# Altium schematic sheet FMCLPCConnector.SchDoc: FMC Connector
size Letter; ProjectTitle: Dan DfMux Mezz; ModelNumber: MGMEZZ04
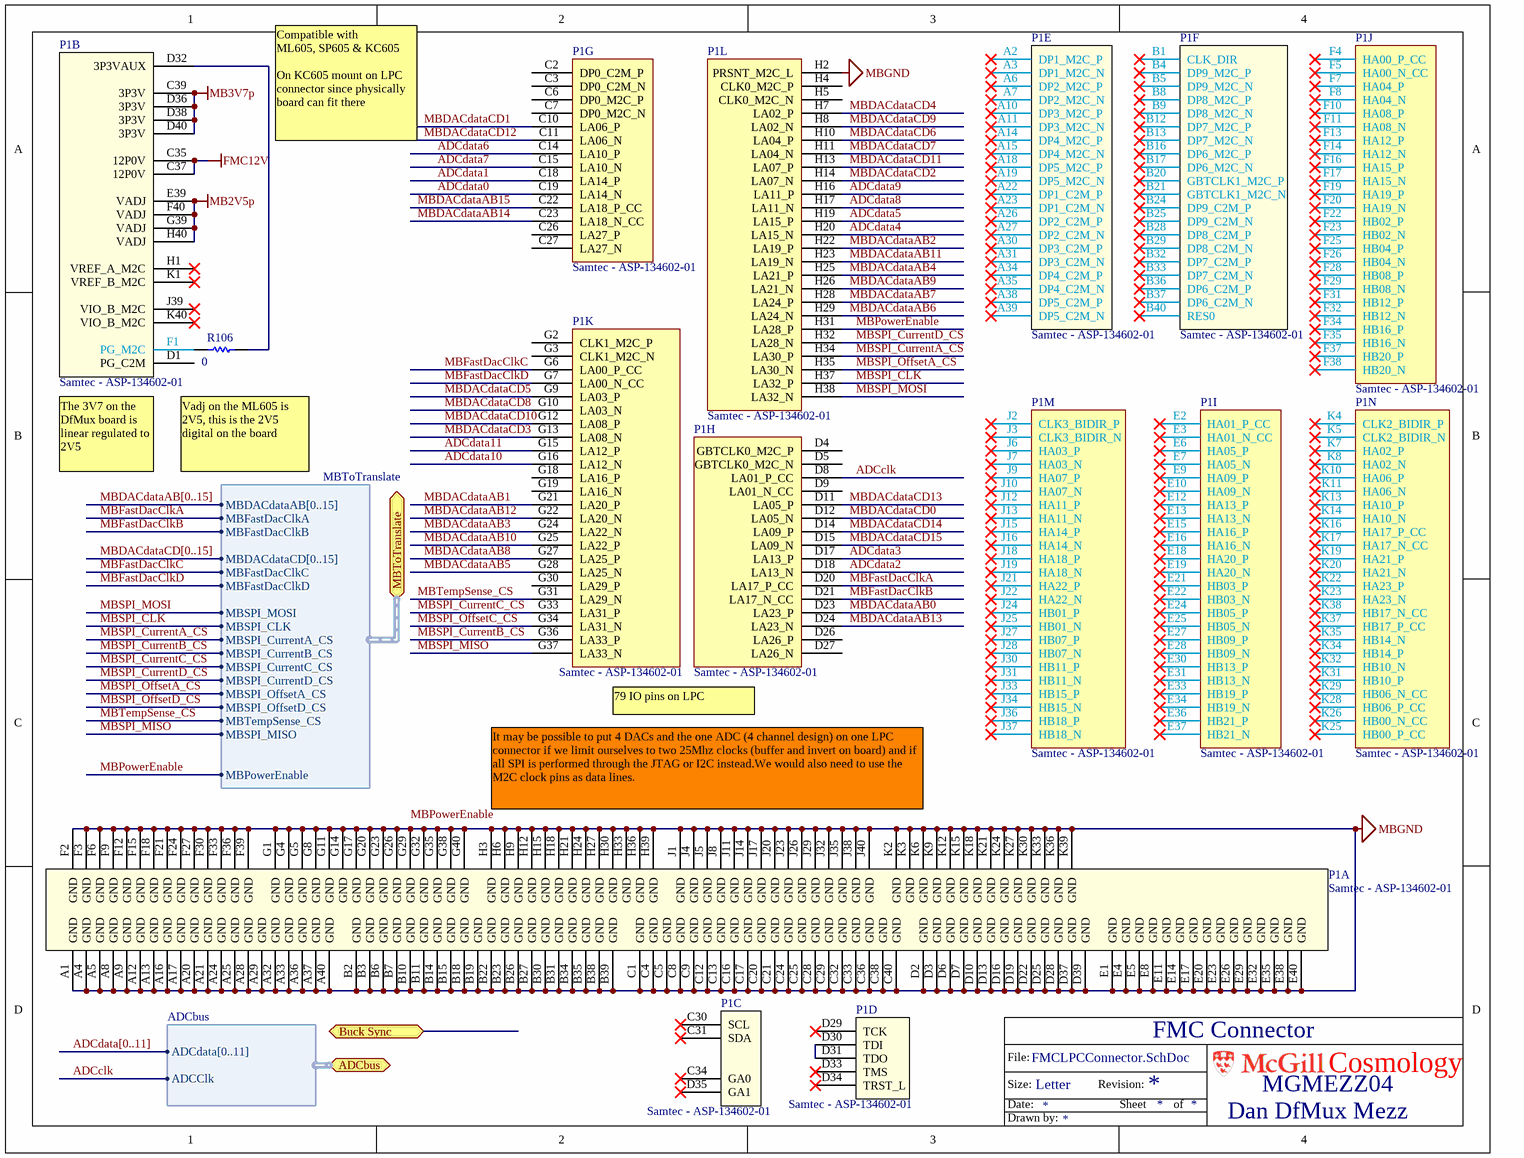
[diagram p0: FMCLPCConnector.SchDoc]

## Parts
P1  Samtec - ASP-134602-01  [BTB-SM1-27-2V400M]  (parts A,B,C,D,E,F,G,H,I,J,K,L,M,N of 14)
R106  0  [0603]

## Ports
ADCbus (harness ADCbus), Buck Sync, MBToTranslate (harness MBToTranslate)

## Harnesses
ADCbus: ADCdata[0..11], ADCClk
MBToTranslate: MBDACdataAB[0..15], MBFastDacClkA, MBSPI_MOSI, MBSPI_CLK, MBFastDacClkB, MBFastDacClkC, MBFastDacClkD, MBDACdataCD[0..15], MBPowerEnable, MBSPI_CurrentA_CS, MBSPI_CurrentB_CS, MBSPI_CurrentC_CS, MBSPI_CurrentD_CS, MBSPI_OffsetA_CS, MBSPI_OffsetD_CS, MBTempSense_CS, MBSPI_MISO

## Nets
FMC12V: P1.C35(12P0V) P1.C37(12P0V)
MB2V5p: P1.E39(VADJ) P1.F40(VADJ) P1.G39(VADJ) P1.H40(VADJ)
MB3V7p: P1.C39(3P3V) P1.D36(3P3V) P1.D38(3P3V) P1.D40(3P3V)
MBGND: P1.A1(GND) P1.A4(GND) P1.A5(GND) P1.A8(GND) P1.A9(GND) P1.A12(GND) P1.A13(GND) P1.A16(GND) P1.A17(GND) P1.A20(GND) P1.A21(GND) P1.A24(GND) P1.A25(GND) P1.A28(GND) P1.A29(GND) P1.A32(GND) P1.A33(GND) P1.A36(GND) P1.A37(GND) P1.A40(GND) P1.B2(GND) P1.B3(GND) P1.B6(GND) P1.B7(GND) P1.B10(GND) P1.B11(GND) P1.B14(GND) P1.B15(GND) P1.B18(GND) P1.B19(GND) P1.B22(GND) P1.B23(GND) P1.B26(GND) P1.B27(GND) P1.B30(GND) P1.B31(GND) P1.B34(GND) P1.B35(GND) P1.B38(GND) P1.B39(GND) P1.C1(GND) P1.C4(GND) P1.C5(GND) P1.C8(GND) P1.C9(GND) P1.C12(GND) P1.C13(GND) P1.C16(GND) P1.C17(GND) P1.C20(GND) P1.C21(GND) P1.C24(GND) P1.C25(GND) P1.C28(GND) P1.C29(GND) P1.C32(GND) P1.C33(GND) P1.C36(GND) P1.C38(GND) P1.C40(GND) P1.D2(GND) P1.D3(GND) P1.D6(GND) P1.D7(GND) P1.D10(GND) P1.D13(GND) P1.D16(GND) P1.D19(GND) P1.D22(GND) P1.D25(GND) P1.D28(GND) P1.D37(GND) P1.D39(GND) P1.E1(GND) P1.E4(GND) P1.E5(GND) P1.E8(GND) P1.E11(GND) P1.E14(GND) P1.E17(GND) P1.E20(GND) P1.E23(GND) P1.E26(GND) P1.E29(GND) P1.E32(GND) P1.E35(GND) P1.E38(GND) P1.E40(GND) P1.F2(GND) P1.F3(GND) P1.F6(GND) P1.F9(GND) P1.F12(GND) P1.F15(GND) P1.F18(GND) P1.F21(GND) P1.F24(GND) P1.F27(GND) P1.F30(GND) P1.F33(GND) P1.F36(GND) P1.F39(GND) P1.G1(GND) P1.G4(GND) P1.G5(GND) P1.G8(GND) P1.G11(GND) P1.G14(GND) P1.G17(GND) P1.G20(GND) P1.G23(GND) P1.G26(GND) P1.G29(GND) P1.G32(GND) P1.G35(GND) P1.G38(GND) P1.G40(GND) P1.H2(PRSNT_M2C_L) P1.H3(GND) P1.H6(GND) P1.H9(GND) P1.H12(GND) P1.H15(GND) P1.H18(GND) P1.H21(GND) P1.H24(GND) P1.H27(GND) P1.H30(GND) P1.H33(GND) P1.H36(GND) P1.H39(GND) P1.J1(GND) P1.J4(GND) P1.J5(GND) P1.J8(GND) P1.J11(GND) P1.J14(GND) P1.J17(GND) P1.J20(GND) P1.J23(GND) P1.J26(GND) P1.J29(GND) P1.J32(GND) P1.J35(GND) P1.J38(GND) P1.J40(GND) P1.K2(GND) P1.K3(GND) P1.K6(GND) P1.K9(GND) P1.K12(GND) P1.K15(GND) P1.K18(GND) P1.K21(GND) P1.K24(GND) P1.K27(GND) P1.K30(GND) P1.K33(GND) P1.K36(GND) P1.K39(GND)
ADCclk: P1.D8(LA01_P_CC) ; port ADCbus.ADCClk
ADCdata0: P1.C19(LA14_N)
ADCdata1: P1.C18(LA14_P)
ADCdata2: P1.D18(LA13_N)
ADCdata3: P1.D17(LA13_P)
ADCdata4: P1.H20(LA15_N)
ADCdata5: P1.H19(LA15_P)
ADCdata6: P1.C14(LA10_P)
ADCdata7: P1.C15(LA10_N)
ADCdata8: P1.H17(LA11_N)
ADCdata9: P1.H16(LA11_P)
ADCdata10: P1.G16(LA12_N)
ADCdata11: P1.G15(LA12_P)
MBDACdataAB0: P1.D23(LA23_P)
MBDACdataAB1: P1.G21(LA20_P)
MBDACdataAB2: P1.H22(LA19_P)
MBDACdataAB3: P1.G24(LA22_N)
MBDACdataAB4: P1.H25(LA21_P)
MBDACdataAB5: P1.G28(LA25_N)
MBDACdataAB6: P1.H29(LA24_N)
MBDACdataAB7: P1.H28(LA24_P)
MBDACdataAB8: P1.G27(LA25_P)
MBDACdataAB9: P1.H26(LA21_N)
MBDACdataAB10: P1.G25(LA22_P)
MBDACdataAB11: P1.H23(LA19_N)
MBDACdataAB12: P1.G22(LA20_N)
MBDACdataAB13: P1.D24(LA23_N)
MBDACdataAB14: P1.C23(LA18_N_CC)
MBDACdataAB15: P1.C22(LA18_P_CC)
MBDACdataCD0: P1.D12(LA05_N)
MBDACdataCD1: P1.C10(LA06_P)
MBDACdataCD2: P1.H14(LA07_N)
MBDACdataCD3: P1.G13(LA08_N)
MBDACdataCD4: P1.H7(LA02_P)
MBDACdataCD5: P1.G9(LA03_P)
MBDACdataCD6: P1.H10(LA04_P)
MBDACdataCD7: P1.H11(LA04_N)
MBDACdataCD8: P1.G10(LA03_N)
MBDACdataCD9: P1.H8(LA02_N)
MBDACdataCD10: P1.G12(LA08_P)
MBDACdataCD11: P1.H13(LA07_P)
MBDACdataCD12: P1.C11(LA06_N)
MBDACdataCD13: P1.D11(LA05_P)
MBDACdataCD14: P1.D14(LA09_P)
MBDACdataCD15: P1.D15(LA09_N)
MBFastDacClkA: P1.D20(LA17_P_CC) ; port MBToTranslate.MBFastDacClkA
MBFastDacClkB: P1.D21(LA17_N_CC) ; port MBToTranslate.MBFastDacClkB
MBFastDacClkC: P1.G6(LA00_P_CC) ; port MBToTranslate.MBFastDacClkC
MBFastDacClkD: P1.G7(LA00_N_CC) ; port MBToTranslate.MBFastDacClkD
MBPowerEnable: P1.H31(LA28_P) ; port MBToTranslate.MBPowerEnable
MBSPI_CLK: P1.H37(LA32_P) ; port MBToTranslate.MBSPI_CLK
MBSPI_CurrentA_CS: P1.H34(LA30_P) ; port MBToTranslate.MBSPI_CurrentA_CS
MBSPI_CurrentB_CS: P1.G36(LA33_P) ; port MBToTranslate.MBSPI_CurrentB_CS
MBSPI_CurrentC_CS: P1.G33(LA31_P) ; port MBToTranslate.MBSPI_CurrentC_CS
MBSPI_CurrentD_CS: P1.H32(LA28_N) ; port MBToTranslate.MBSPI_CurrentD_CS
MBSPI_MISO: P1.G37(LA33_N) ; port MBToTranslate.MBSPI_MISO
MBSPI_MOSI: P1.H38(LA32_N) ; port MBToTranslate.MBSPI_MOSI
MBSPI_OffsetA_CS: P1.H35(LA30_N) ; port MBToTranslate.MBSPI_OffsetA_CS
MBSPI_OffsetC_CS: P1.G34(LA31_N)
MBSPI_OffsetD_CS: port MBToTranslate.MBSPI_OffsetD_CS
MBTempSense_CS: P1.G31(LA29_N) ; port MBToTranslate.MBTempSense_CS
NetP1_D30: P1.D30(TDI) P1.D31(TDO)
NetP1_D32: P1.D32(3P3VAUX) R106.1
NetP1_F1: P1.F1(PG_M2C) R106.2

Not connected (* = marked no-connect by the designer): P1 A2(DP1_M2C_P)* A3(DP1_M2C_N)* A6(DP2_M2C_P)* A7(DP2_M2C_N)* A10(DP3_M2C_P)* A11(DP3_M2C_N)* A14(DP4_M2C_P)* A15(DP4_M2C_N)* A18(DP5_M2C_P)* A19(DP5_M2C_N)* A22(DP1_C2M_P)* A23(DP1_C2M_N)* A26(DP2_C2M_P)* A27(DP2_C2M_N)* A30(DP3_C2M_P)* A31(DP3_C2M_N)* A34(DP4_C2M_P)* A35(DP4_C2M_N)* A38(DP5_C2M_P)* A39(DP5_C2M_N)* B1(CLK_DIR)* B4(DP9_M2C_P)* B5(DP9_M2C_N)* B8(DP8_M2C_P)* B9(DP8_M2C_N)* B12(DP7_M2C_P)* B13(DP7_M2C_N)* B16(DP6_M2C_P)* B17(DP6_M2C_N)* B20(GBTCLK1_M2C_P)* B21(GBTCLK1_M2C_N)* B24(DP9_C2M_P)* B25(DP9_C2M_N)* B28(DP8_C2M_P)* B29(DP8_C2M_N)* B32(DP7_C2M_P)* B33(DP7_C2M_N)* B36(DP6_C2M_P)* B37(DP6_C2M_N)* B40(RES0)* C2(DP0_C2M_P) C3(DP0_C2M_N) C6(DP0_M2C_P) C7(DP0_M2C_N) C26(LA27_P) C27(LA27_N) C30(SCL)* C31(SDA)* C34(GA0)* D1(PG_C2M) D4(GBTCLK0_M2C_P) D5(GBTCLK0_M2C_N) D9(LA01_N_CC) D26(LA26_P) D27(LA26_N) D29(TCK)* D33(TMS)* D34(TRST_L)* D35(GA1)* E2(HA01_P_CC)* E3(HA01_N_CC)* E6(HA05_P)* E7(HA05_N)* E9(HA09_P)* E10(HA09_N)* E12(HA13_P)* E13(HA13_N)* E15(HA16_P)* E16(HA16_N)* E18(HA20_P)* E19(HA20_N)* E21(HB03_P)* E22(HB03_N)* E24(HB05_P)* E25(HB05_N)* E27(HB09_P)* E28(HB09_N)* E30(HB13_P)* E31(HB13_N)* E33(HB19_P)* E34(HB19_N)* E36(HB21_P)* E37(HB21_N)* F4(HA00_P_CC)* F5(HA00_N_CC)* F7(HA04_P)* F8(HA04_N)* F10(HA08_P)* F11(HA08_N)* F13(HA12_P)* F14(HA12_N)* F16(HA15_P)* F17(HA15_N)* F19(HA19_P)* F20(HA19_N)* F22(HB02_P)* F23(HB02_N)* F25(HB04_P)* F26(HB04_N)* F28(HB08_P)* F29(HB08_N)* F31(HB12_P)* F32(HB12_N)* F34(HB16_P)* F35(HB16_N)* F37(HB20_P)* F38(HB20_N)* G2(CLK1_M2C_P) G3(CLK1_M2C_N) G18(LA16_P) G19(LA16_N) G30(LA29_P) H1(VREF_A_M2C)* H4(CLK0_M2C_P) H5(CLK0_M2C_N) J2(CLK3_BIDIR_P)* J3(CLK3_BIDIR_N)* J6(HA03_P)* J7(HA03_N)* J9(HA07_P)* J10(HA07_N)* J12(HA11_P)* J13(HA11_N)* J15(HA14_P)* J16(HA14_N)* J18(HA18_P)* J19(HA18_N)* J21(HA22_P)* J22(HA22_N)* J24(HB01_P)* J25(HB01_N)* J27(HB07_P)* J28(HB07_N)* J30(HB11_P)* J31(HB11_N)* J33(HB15_P)* J34(HB15_N)* J36(HB18_P)* J37(HB18_N)* J39(VIO_B_M2C)* K1(VREF_B_M2C)* K4(CLK2_BIDIR_P)* K5(CLK2_BIDIR_N)* K7(HA02_P)* K8(HA02_N)* K10(HA06_P)* K11(HA06_N)* K13(HA10_P)* K14(HA10_N)* K16(HA17_P_CC)* K17(HA17_N_CC)* K19(HA21_P)* K20(HA21_N)* K22(HA23_P)* K23(HA23_N)* K25(HB00_P_CC)* K26(HB00_N_CC)* K28(HB06_P_CC)* K29(HB06_N_CC)* K31(HB10_P)* K32(HB10_N)* K34(HB14_P)* K35(HB14_N)* K37(HB17_P_CC)* K38(HB17_N_CC)* K40(VIO_B_M2C)*

## Buses and harness runs
bus ADCdata[0..11]
bus MBDACdataAB[0..15]
bus MBDACdataCD[0..15]

## Notes on the sheet
- Compatible with
  ML605, SP605 & KC605
  On KC605 mount on LPC connector since physically board can fit there
- (near P1) The 3V7 on the DfMux board is linear regulated to 2V5
- Vadj on the ML605 is 2V5, this is the 2V5 digital on the board
- (near P1) 79 IO pins on LPC
- It may be possible to put 4 DACs and the one ADC (4 channel design) on one LPC connector if we limit ourselves to two 25Mhz clocks (buffer and invert on board) and if all SPI is performed through the JTAG or I2C instead.We would also need to use the M2C clock pins as data lines.
- Labels drawn without touching a wire or pin: MBPowerEnable
- File:
- Size:
- Date:
- Letter
- Revision:
- Sheet
- of
- Cosmology
- Drawn by:

## Library data of the parts
P1 = Samtec - ASP-134602-01: Samtec ASP-134602-01
R106 = RES 0603: Resistor; Manufacturer: Generic; Part Constraints: 1% 1/10W 100ppm 0603; Manufacturers Part Number: Generic; Value: 0; Type: Resistor; SupplierUnitCost: 0